# Altium schematic sheet MPU9250.SchDoc
size A4
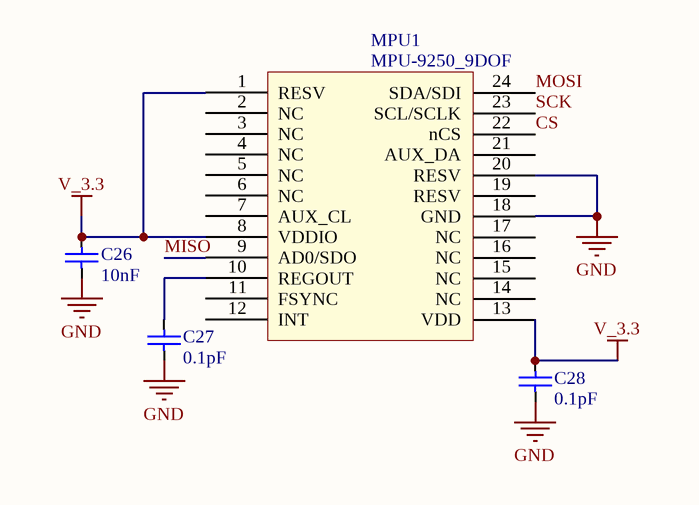
[diagram p0: MPU9250.SchDoc]

## Parts
C26  10nF  [CAP0603R]
C27  0.1pF  [CAP0603R]
C28  0.1pF  [CAP0603R]
MPU1  MPU-9250_9DOF  [QFN424_MPU-9250]

## Nets
GND: C26.2 C27.2 C28.2 MPU1.18(GND) MPU1.20(RESV)
V_3.3: C26.1 C28.1 MPU1.1(RESV) MPU1.8(VDDIO) MPU1.13(VDD)
CS: MPU1.22(nCS)
MISO: MPU1.9(AD0/SDO)
MOSI: MPU1.24(SDA/SDI)
SCK: MPU1.23(SCL/SCLK)
NetC27_1: C27.1 MPU1.10(REGOUT)

Not connected (* = marked no-connect by the designer): MPU1 2(NC) 3(NC) 4(NC) 5(NC) 6(NC) 7(AUX_CL) 11(FSYNC) 12(INT) 14(NC) 15(NC) 16(NC) 17(NC) 19(RESV) 21(AUX_DA)

## Library data of the parts
C26-C28 = C: Capacitor; Manufacturer: Microchip Technology; Manufacturer Part Num: MIC5378YC5-TR; Class I: Passive; Revision: July-2002: Re-released for DXP Platform.; Supplier 1: Digikey; Supplier Part Number 1: *; Supplier Part Number 1: 1611-MIC5378YC5-CT-ND
  C26: Value: 10nF
  C27 C28: Value: 0.1pF
MPU1 = MPU-9250: IMU ACCEL/GYRO/MAG I2C/SPI 24QFN